# Altium schematic sheet Mechanical.SchDoc: Title
size Tabloid; Revision: A; ProjectTitle: CDU: CAN Display Unit
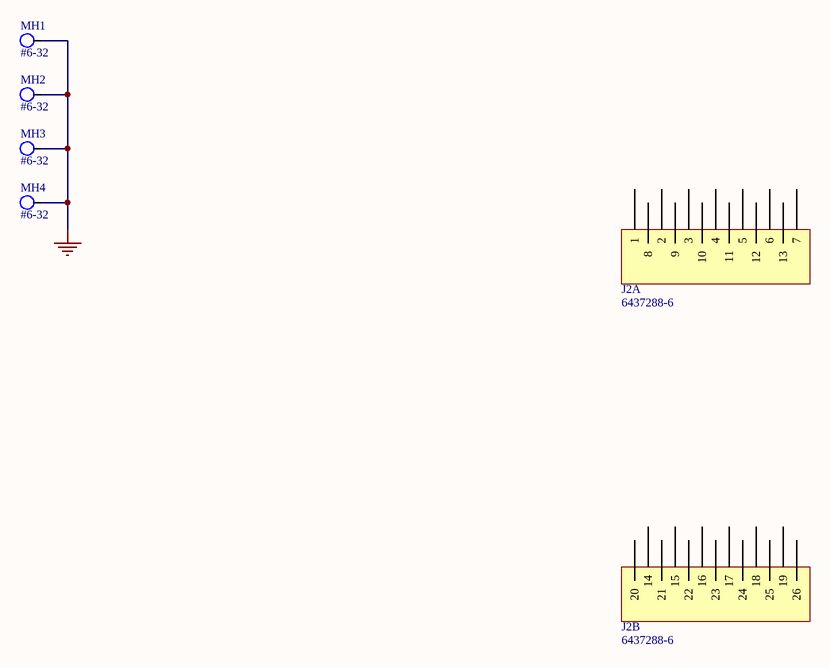
[diagram p0: Mechanical.SchDoc]

## Parts
J2  6437288-6  [6437288-6]  (parts A,B of 2)
MH1  #6-32  [MH-6-32]
MH2  #6-32  [MH-6-32]
MH3  #6-32  [MH-6-32]
MH4  #6-32  [MH-6-32]

## Nets
GND: MH1.1 MH2.1 MH3.1 MH4.1

Not connected (* = marked no-connect by the designer): J2 1 2 3 4 5 6 7 8 9 10 11 12 13 14 15 16 17 18 19 20 21 22 23 24 25 26

## Notes on the sheet
- Date:
- Revision:
- Sheet:
- /

## Library data of the parts
J2 = 6437288-6: Superseal 26-way vertical PCB header
MH1-MH4 = MH-6-32